# Altium schematic sheet Volts Sample (SMD).SchDoc
size A4
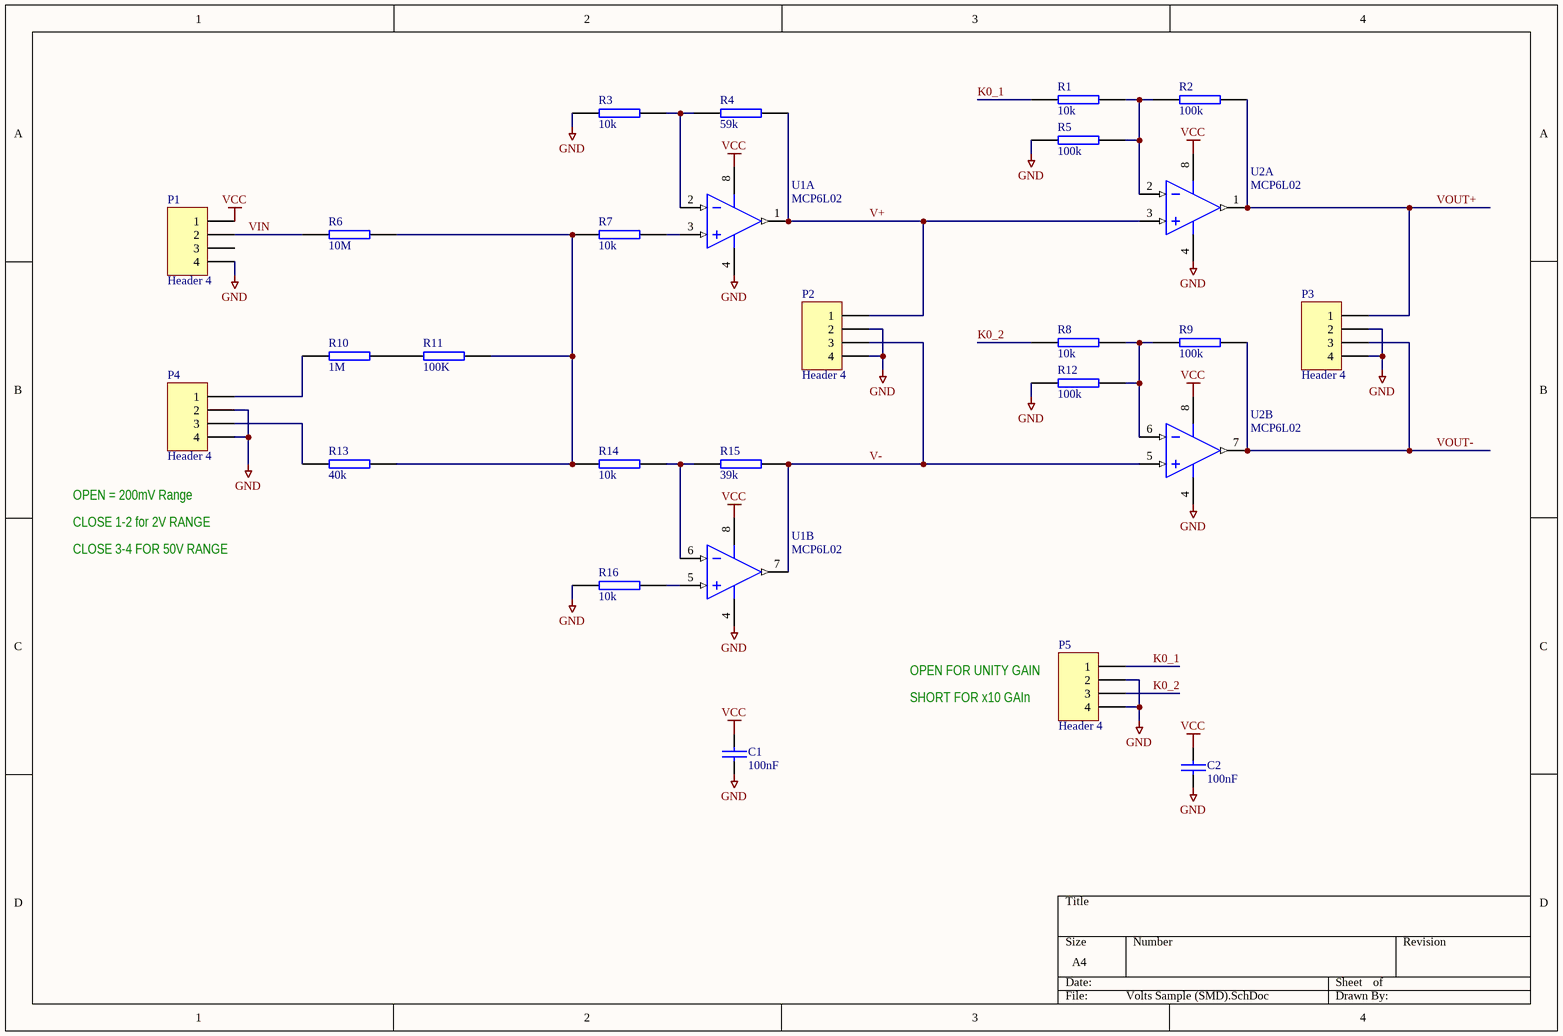
[diagram p0: Volts Sample (SMD).SchDoc]

## Parts
C1  100nF  [CAP (3D) - 0603]
C2  100nF  [CAP (3D) - 0603]
P1  Header 4  [HDR1X4]
P2  Header 4  [HDR1X4]
P3  Header 4  [HDR1X4]
P4  Header 4  [HDR1X4]
P5  Header 4  [HDR1X4]
R1  10k  [RES (3D) - 0603]
R2  100k  [RES (3D) - 0603]
R3  10k  [RES (3D) - 0603]
R4  59k  [RES (3D) - 0603]
R5  100k  [RES (3D) - 0603]
R6  10M  [RES (3D) - 0603]
R7  10k  [RES (3D) - 0603]
R8  10k  [RES (3D) - 0603]
R9  100k  [RES (3D) - 0603]
R10  1M  [RES (3D) - 0603]
R11  100K  [RES (3D) - 0603]
R12  100k  [RES (3D) - 0603]
R13  40k  [RES (3D) - 0603]
R14  10k  [RES (3D) - 0603]
R15  39k  [RES (3D) - 0603]
R16  10k  [RES (3D) - 0603]
U1  MCP6L02  [SO-8]  (parts A,B of 2)
U2  MCP6L02  [SO-8]  (parts A,B of 2)

## Nets
GND: C1.2 C2.2 P1.4 P2.2 P2.4 P3.2 P3.4 P4.2 P4.4 P5.2 P5.4 R3.1 R5.1 R12.1 R16.1 U1.4(GND) U2.4(GND)
VCC: C1.1 C2.1 P1.1 U1.8(V+) U2.8(V+)
K0_1: P5.1 R1.1
K0_2: P5.3 R8.1
V+: P2.1 R4.2 U1.1(OUTA) U2.3(INA+)
V-: P2.3 R15.2 U1.7(OUTB) U2.5(INB+)
VIN: P1.2 R6.1
VOUT+: P3.1 R2.2 U2.1(OUTA)
VOUT-: P3.3 R9.2 U2.7(OUTB)
NetP4_1: P4.1 R10.1
NetP4_3: P4.3 R13.1
NetR1_2: R1.2 R2.1 R5.2 U2.2(INA-)
NetR3_2: R3.2 R4.1 U1.2(INA-)
NetR6_2: R6.2 R7.1 R11.2 R13.2 R14.1
NetR7_2: R7.2 U1.3(INA+)
NetR8_2: R8.2 R9.1 R12.2 U2.6(INB-)
NetR10_2: R10.2 R11.1
NetR14_2: R14.2 R15.1 U1.6(INB-)
NetR16_2: R16.2 U1.5(INB+)

Not connected (* = marked no-connect by the designer): P1 3

## Notes on the sheet
- (near P4) OPEN = 200mV Range
- CLOSE 1-2 for 2V RANGE
- CLOSE 3-4 FOR 50V RANGE
- (near P5) OPEN FOR UNITY GAIN
- SHORT FOR x10 GAIn

## Library data of the parts
C1 C2 = CAP: CAPACITOR SMD 0603; Manufacturer: Murata; Manufacturer Part No.: GRM155R61C104KA88D; value: 100nF; Mouser Part no.: 81-GRM155R61C104KA8D; Farnell Part no.: 1414610; Web link: http://au.mouser.com/ProductDetail/Murata/GRM155R61C104KA88D/?qs=sGAEpiMZZMvQvaS66kI3TkNFPW5pBWErgqKrdkfeYZ0%3d
P1-P5 = Header 4: Header, 4-Pin; LatestRevisionDate: 17-Jul-2002; LatestRevisionNote: Re-released for DXP Platform.; Publisher: Altium Limited
R1 R3 R7 R8 R14 R16 = RES SMD 0603 10k: RESISTOR SMD 0603 10k; Manufacturer: Bourns; Manufacturer Part No.: CR0603FX-1002ELF; Mouser Part no.: 652-CR0603FX-1002ELF; Web link: http://au.mouser.com/Search/Refine.aspx?Keyword=652-CR0603FX-1002ELF; value: 10k
R2 R4-R6 R9-R13 = RES SMD 0603 39k: RESISTOR SMD 0603 39k; Manufacturer: Bourns
  R2 R5 R9 R12: value: 100k
  R4: value: 59k
  R6: value: 10M
  R10: value: 1M
  R11: value: 100K
  R13: value: 40k
R15 = RES SMD 0603 39k: RESISTOR SMD 0603 39k; Manufacturer: Bourns; Manufacturer Part No.: CR0603-FX-3902ELF; Mouser Part no.: 652-CR0603FX-3902ELF; Web link: http://au.mouser.com/ProductDetail/Bourns/CR0603-FX-3902ELF/?qs=sGAEpiMZZMukHu%252bjC5l7YStVON7zpqsW55hf5FaCutw%3d; value: 39k
U1 U2 = MCP6L02: Value: MCP6L02